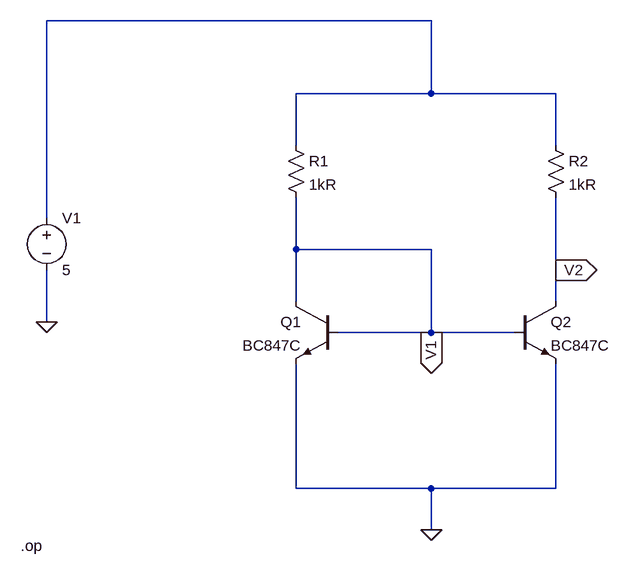
[diagram p0: schematic dc_transistor_aynalama.asc]
dc_transistor_aynalama.asc, the LTspice schematic file:
Version 4
SHEET 1 1012 680
WIRE 736 -368 144 -368
WIRE 736 -256 736 -368
WIRE 736 -256 528 -256
WIRE 928 -256 736 -256
WIRE 528 -176 528 -256
WIRE 928 -176 928 -256
WIRE 144 -64 144 -368
WIRE 528 -16 528 -96
WIRE 736 -16 528 -16
WIRE 928 16 928 -96
WIRE 528 64 528 -16
WIRE 928 64 928 16
WIRE 144 96 144 16
WIRE 736 112 736 -16
WIRE 736 112 592 112
WIRE 864 112 736 112
WIRE 528 352 528 160
WIRE 736 352 528 352
WIRE 928 352 928 160
WIRE 928 352 736 352
WIRE 736 416 736 352
FLAG 736 416 0
FLAG 144 96 0
FLAG 736 112 V1
IOPIN 736 112 Out
FLAG 928 16 V2
IOPIN 928 16 Out
SYMBOL voltage 144 -80 R0
WINDOW 123 0 0 Left 0
WINDOW 39 0 0 Left 0
SYMATTR InstName V1
SYMATTR Value 5
SYMBOL npn 592 64 M0
SYMATTR InstName Q1
SYMATTR Value BC847C
SYMBOL npn 864 64 R0
SYMATTR InstName Q2
SYMATTR Value BC847C
SYMBOL res 512 -192 R0
SYMATTR InstName R1
SYMATTR Value 1kR
SYMBOL res 912 -192 R0
SYMATTR InstName R2
SYMATTR Value 1kR
TEXT 104 440 Left 2 !.op

The netlist it stands for:
* dc_transistor_aynalama.asc
V1 N001 0 5
Q1 V1 V1 0 0 BC847C
Q2 V2 V1 0 0 BC847C
R1 N001 V1 1kR
R2 N001 V2 1kR
.model NPN NPN
.model PNP PNP
.lib standard.bjt
.op
.backanno
.end